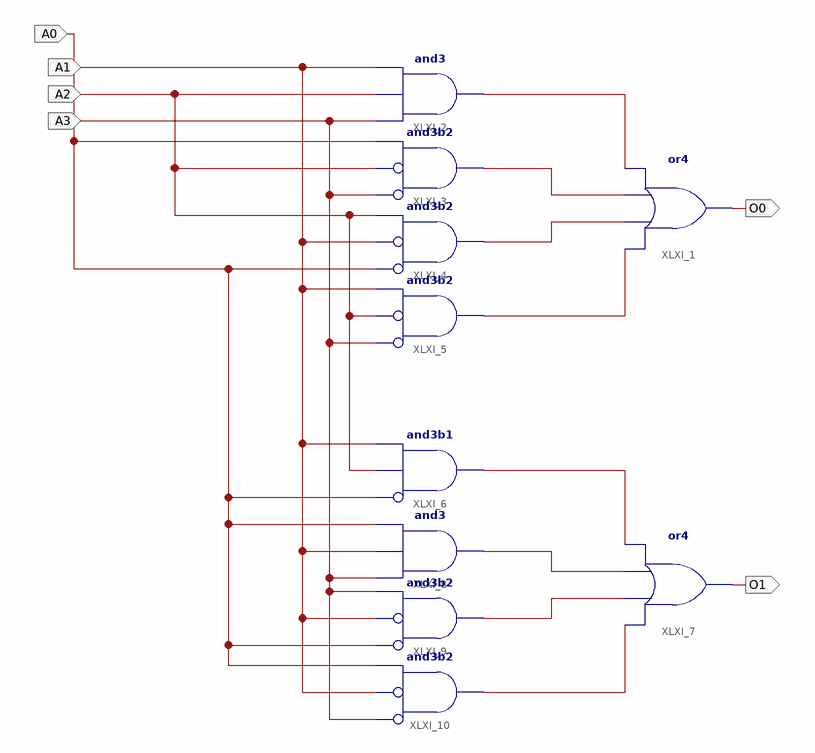
[diagram p0: schematic sheet 1]
// Xilinx ISE schematic S1.sch (xc9500xl) as structural Verilog: 10 symbols, 6 ports
module S1 (
  input  A1,
  input  A2,
  input  A3,
  input  A0,
  output O0,
  output O1
);

  wire XLXN_1, XLXN_2, XLXN_3, XLXN_4, XLXN_19, XLXN_20, XLXN_21, XLXN_22;

  or XLXI_1 (O0, XLXN_4, XLXN_3, XLXN_2, XLXN_1);
  and XLXI_2 (XLXN_1, A3, A2, A1);
  and XLXI_3 (XLXN_2, ~A3, ~A2, A0);  // and3b2
  and XLXI_4 (XLXN_3, ~A0, ~A1, A2);  // and3b2
  and XLXI_5 (XLXN_4, ~A3, ~A2, A1);  // and3b2
  and XLXI_6 (XLXN_19, ~A0, A2, A1);  // and3b1
  or XLXI_7 (O1, XLXN_22, XLXN_21, XLXN_20, XLXN_19);
  and XLXI_8 (XLXN_20, A3, A1, A0);
  and XLXI_9 (XLXN_21, ~A0, ~A1, A3);  // and3b2
  and XLXI_10 (XLXN_22, ~A3, ~A1, A0);  // and3b2
endmodule
